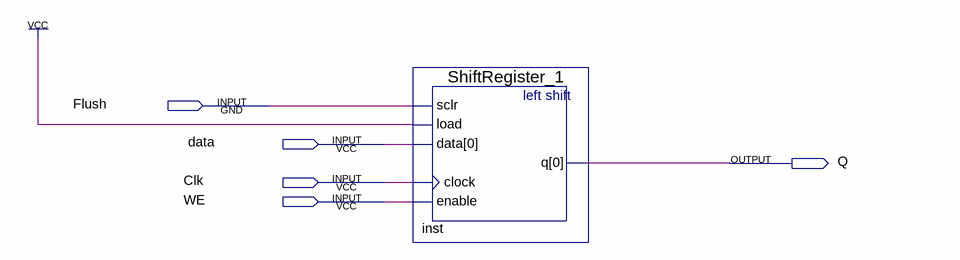
[diagram p0: schematic sheet]
// Quartus schematic ShiftRegister1.bdf as structural Verilog: 1 symbols, 5 pins
module ShiftRegister1 (
  input  Flush,
  input  data,
  input  Clk,
  input  WE,
  output Q
);

  ShiftRegister_1 inst (.sclr(Flush), .load(1'b1), .data(data), .clock(Clk), .enable(WE), .q(Q));
endmodule
